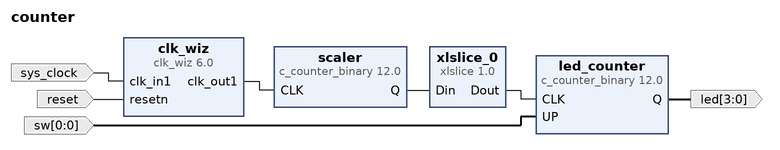
[diagram p0: block diagram of the top level]
# Vivado block design counter, xc7a100tcsg324-1, Vivado 2019.1
create_bd_design counter

create_bd_port -dir O -from 3 -to 0 -type data led
create_bd_port -dir I -from 0 -to 0 -type data sw
create_bd_port -dir I -type clk sys_clock
set_property -dict {CONFIG.FREQ_HZ 100000000 CONFIG.PHASE 0.000} [get_bd_ports sys_clock]
create_bd_port -dir I -type rst reset
set_property -dict {CONFIG.POLARITY ACTIVE_LOW} [get_bd_ports reset]

create_bd_cell -type ip -vlnv xilinx.com:ip:c_counter_binary:12.0 led_counter
set_property -dict {CONFIG.Count_Mode UPDOWN CONFIG.Output_Width 4} [get_bd_cells led_counter]
create_bd_cell -type ip -vlnv xilinx.com:ip:c_counter_binary:12.0 scaler
set_property -dict {CONFIG.Output_Width 22} [get_bd_cells scaler]
create_bd_cell -type ip -vlnv xilinx.com:ip:clk_wiz:6.0 clk_wiz
set_property -dict [list \
  CONFIG.CLKOUT1_JITTER 374.246 \
  CONFIG.CLKOUT1_PHASE_ERROR 241.356 \
  CONFIG.CLKOUT1_REQUESTED_OUT_FREQ 8.6 \
  CONFIG.CLK_IN1_BOARD_INTERFACE sys_clock \
  CONFIG.MMCM_CLKFBOUT_MULT_F 37.625 \
  CONFIG.MMCM_CLKOUT0_DIVIDE_F 109.375 \
  CONFIG.MMCM_DIVCLK_DIVIDE 4 \
  CONFIG.RESET_BOARD_INTERFACE reset \
  CONFIG.RESET_PORT resetn \
  CONFIG.RESET_TYPE ACTIVE_LOW \
  CONFIG.USE_BOARD_FLOW true \
] [get_bd_cells clk_wiz]
create_bd_cell -type ip -vlnv xilinx.com:ip:xlslice:1.0 xlslice_0
set_property -dict {CONFIG.DIN_FROM 21 CONFIG.DIN_TO 21 CONFIG.DIN_WIDTH 22} [get_bd_cells xlslice_0]

# ---- connections ----

connect_bd_net [get_bd_pins led_counter/Q] [get_bd_ports led]
connect_bd_net [get_bd_ports sw] [get_bd_pins led_counter/UP]
connect_bd_net [get_bd_pins scaler/Q] [get_bd_pins xlslice_0/Din]
connect_bd_net [get_bd_pins xlslice_0/Dout] [get_bd_pins led_counter/CLK]
connect_bd_net [get_bd_pins clk_wiz/clk_out1] [get_bd_pins scaler/CLK]
connect_bd_net [get_bd_ports sys_clock] [get_bd_pins clk_wiz/clk_in1]
connect_bd_net [get_bd_ports reset] [get_bd_pins clk_wiz/resetn]

validate_bd_design
save_bd_design
